# Altium schematic sheet WakameBoard.SchDoc
size 569 x 459 mm
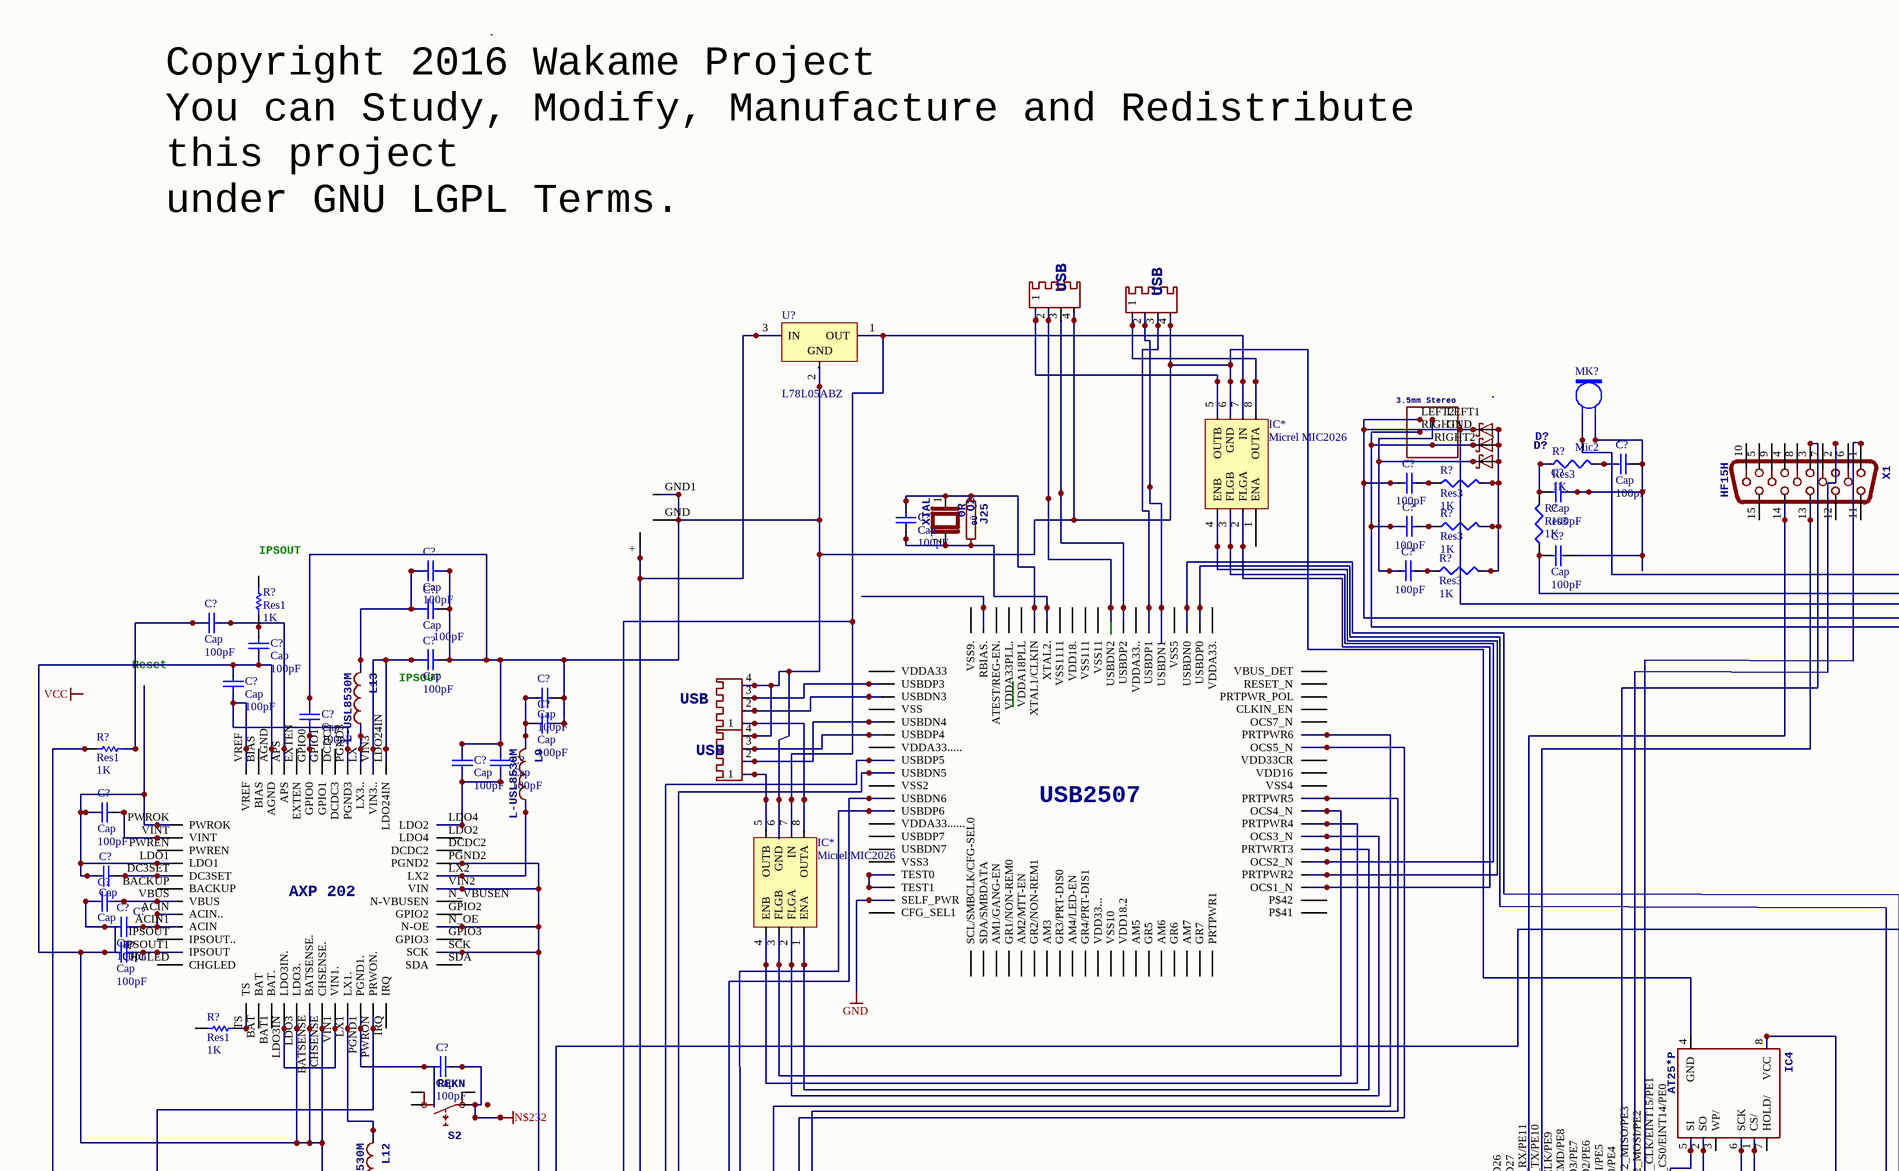
[diagram p0: WakameBoard.SchDoc, top left]
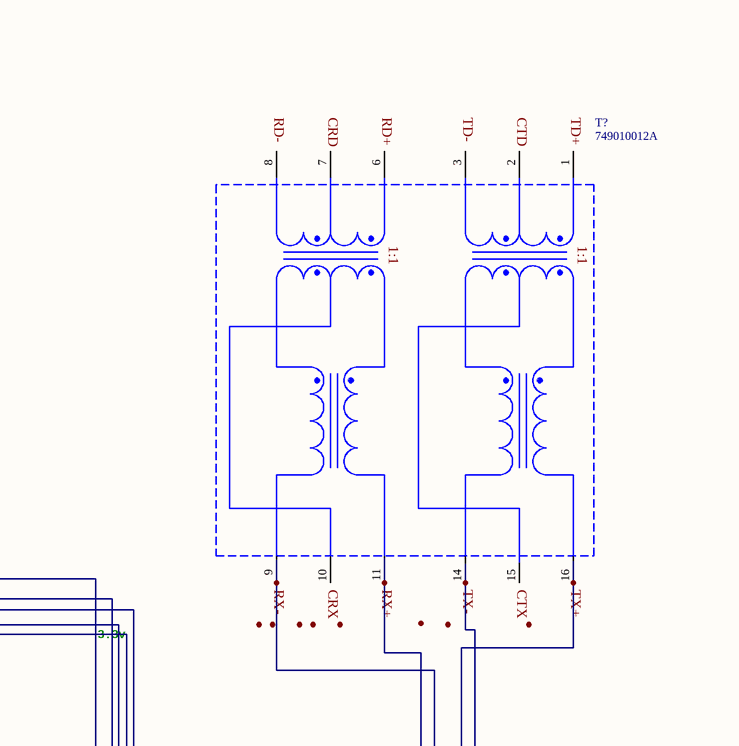
[diagram p1: WakameBoard.SchDoc, top right]
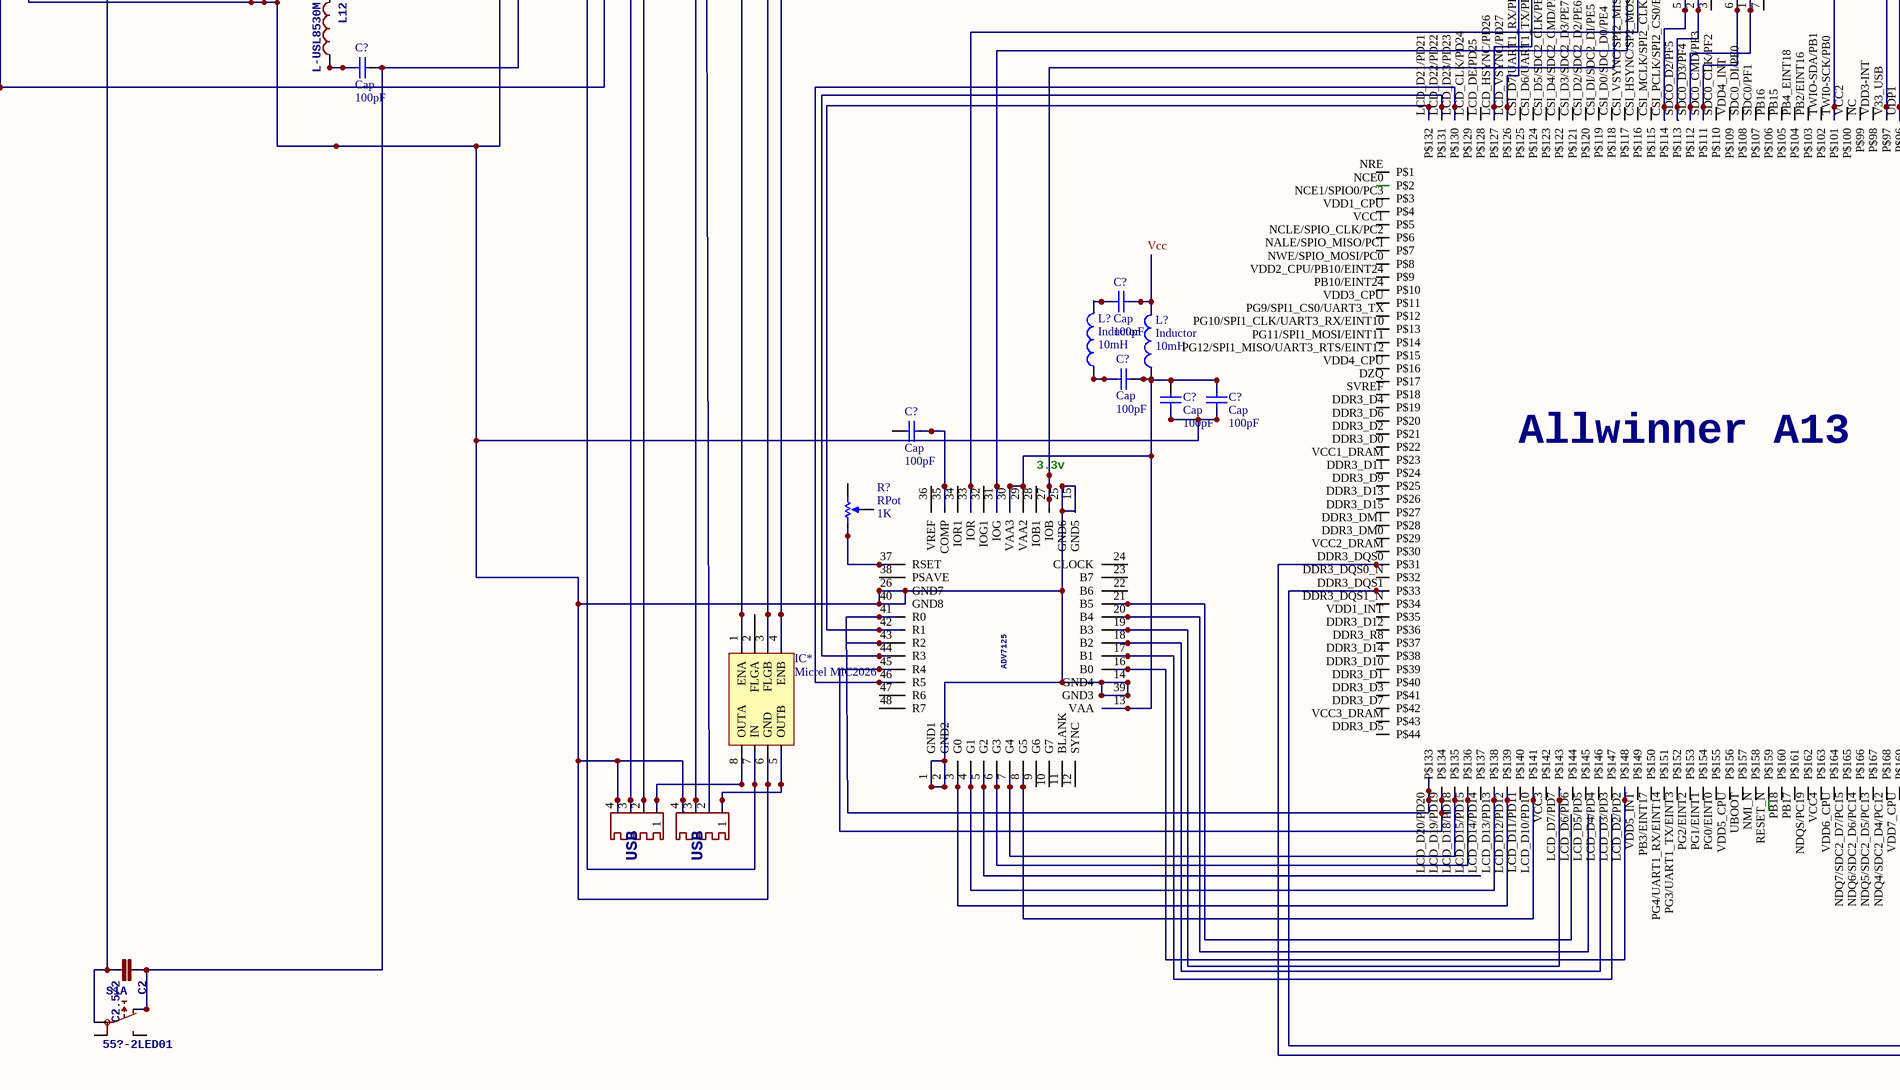
[diagram p2: WakameBoard.SchDoc, bottom left]
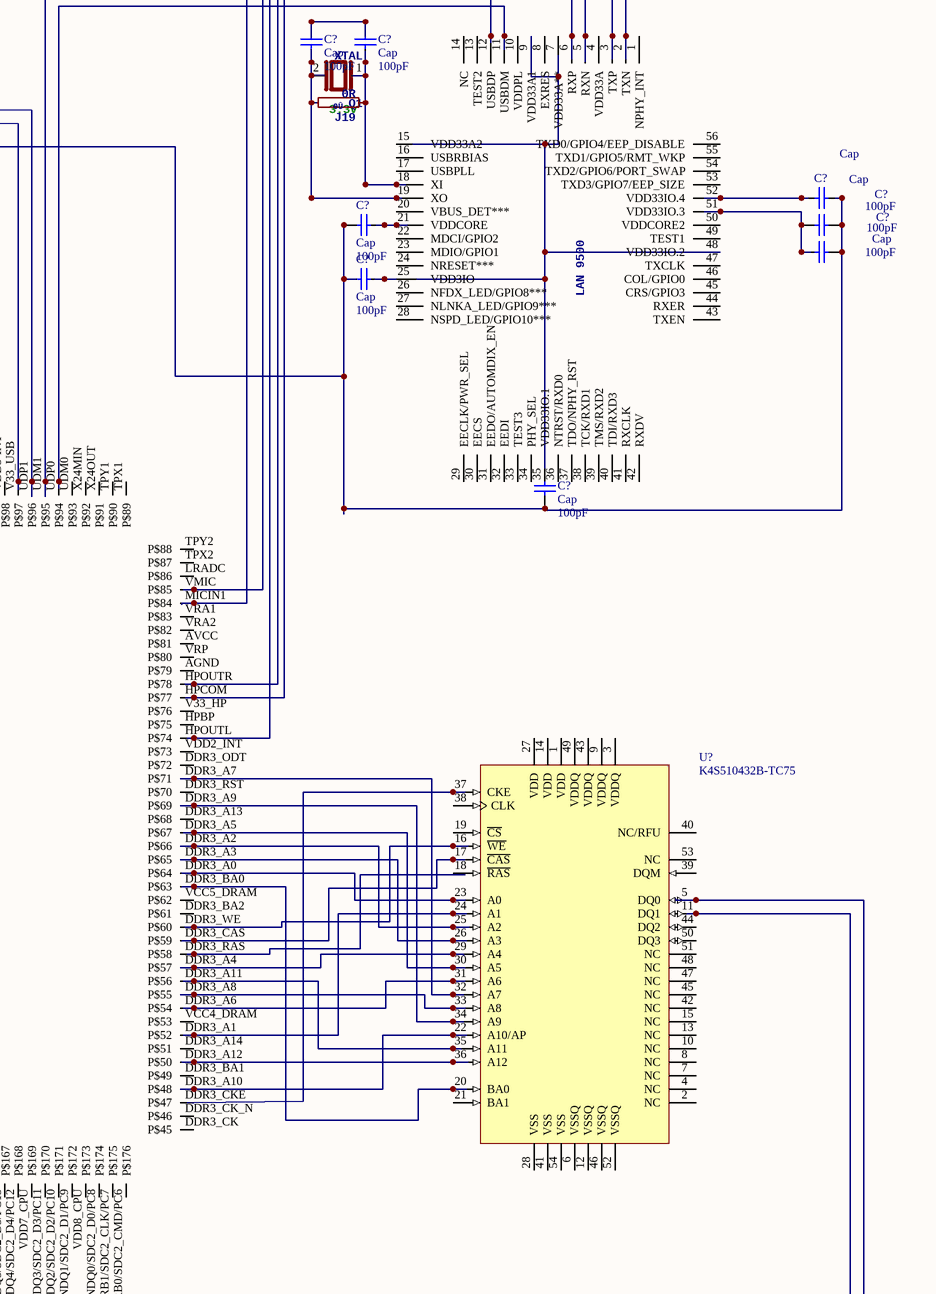
[diagram p3: WakameBoard.SchDoc, bottom right]

## Parts
(Parts that share a designator on the sheet are numbered #1, #2 ... from top to bottom, then left to right.)
C2  C2.5/2  [C2.5-2]
C?#1  Cap  value 100pF  [RAD-0.3]
C?#2  .  value 100pF  [RAD-0.3]
C?#3  Cap  value 100pF  [RAD-0.3]
C?#4  .  value 100pF  [RAD-0.3]
C?#5  Cap  value 100pF  [RAD-0.3]
C?#6  Cap  value 100pF  [RAD-0.3]
C?#7  Cap  value 100pF  [RAD-0.3]
C?#8  .  value 100pF  [RAD-0.3]
C?#9  Cap  value 100pF  [RAD-0.3]
C?#10  Cap  value 100pF  [RAD-0.3]
C?#11  Cap  value 100pF  [RAD-0.3]
C?#12  Cap  value 100pF  [RAD-0.3]
C?#13  Cap  value 100pF  [RAD-0.3]
C?#14  Cap  value 100pF  [RAD-0.3]
C?#15  Cap  value 100pF  [RAD-0.3]
C?#16  Cap  value 100pF  [RAD-0.3]
C?#17  Cap  value 100pF  [RAD-0.3]
C?#18  Cap  value 100pF  [RAD-0.3]
C?#19  Cap  value 100pF  [RAD-0.3]
C?#20  Cap  value 100pF  [RAD-0.3]
C?#21  Cap  value 100pF  [RAD-0.3]
C?#22  Cap  [RAD-0.3]
C?#23  Cap  [RAD-0.3]
C?#24  Cap  value 100pF  [RAD-0.3]
C?#25  Cap  value 100pF  [RAD-0.3]
C?#26  Cap  value 100pF  [RAD-0.3]
C?#27  Cap  value 100pF  [RAD-0.3]
C?#28  Cap  value 100pF  [RAD-0.3]
C?#29  Cap  value 100pF  [RAD-0.3]
C?#30  Cap  value 100pF  [RAD-0.3]
C?#31  Cap  value 100pF  [RAD-0.3]
C?#32  Cap  value 100pF  [RAD-0.3]
C?#33  Cap  value 100pF  [RAD-0.3]
C?#34  Cap  value 100pF  [RAD-0.3]
C?#35  Cap  value 100pF  [RAD-0.3]
C?#36  Cap  value 100pF  [RAD-0.3]
C?#37  Cap  value 100pF  [RAD-0.3]
C?#38  Cap  value 100pF  [RAD-0.3]
D?#1  .  [DIODE_DO35-7]
D?#2  .  [DIODE_DO35-7]
D?#3  .  [DIODE_DO35-7]
IC4  AT25*P  [DIL08]
IC*#1  Micrel MIC2026  [8-Pin SOIC]
IC*#2  Micrel MIC2026  [8-Pin SOIC]
IC*#3  Micrel MIC2026  [8-Pin SOIC]
J19  0R  [0R/10]
J25  0R  [0R/10]
L9  L-USL8530M  [L8530M]
L12  L-USL8530M  [L8530M]
L13  L-USL8530M  [L8530M]
L?#1  Inductor  value 10mH  [0402-A]
L?#2  Inductor  value 10mH  [0402-A]
MK?  Mic2  [PIN2]
Q1  XTAL  [Q]
Q2  XTAL  [Q]
R?#1  Res3  value 1K  [J1-0603]
R?#2  Res3  value 1K  [J1-0603]
R?#3  Res3  value 1K  [J1-0603]
R?#4  Res3  value 1K  [J1-0603]
R?#5  Res3  value 1K  [J1-0603]
R?#6  Res1  value 1K  [AXIAL-0.3]
R?#7  Res1  value 1K  [AXIAL-0.3]
R?#8  Res1  value 1K  [AXIAL-0.3]
R?#9  RPot  value 1K  [VR5]
S1  55?-2LED01  [5501-2LED]  (part A of 3)
S2  REKN  [REKN]
T?  749010012A  [749010012A]
U$1  ALLWINNER-A13  [PG-LQFP-176-2]  (value not drawn)
U$3  ADV7125  [LFCSP48]
U$4  AXP202  [QFN48]  (value not drawn)
U$6  PWR  [SCD-014-A]  (value not drawn)
U$7  LAN9500  [QFN56]  (value not drawn)
U$10  35MMSTEREOJACK  [PG203J]  (value not drawn)
U$11  USB2507  [TQFP80]
U?#1  L78L05ABZ  [TO92]
U?#2  K4S510432B-TC75  [54_TSOP2_400AF_N]
X1  HF15H  [HDF15H]
X2  USB-A003  [USB-A003]  (value not drawn)
X3  USB-A003  [USB-A003]  (value not drawn)
X4  USB-A003  [USB-A003]  (value not drawn)
X5  USB-A003  [USB-A003]  (value not drawn)
X6  USB-A003  [USB-A003]  (value not drawn)
X7  USB-A003  [USB-A003]  (value not drawn)

## Nets
GND: U$11.SELF_PWR
N$232: C?#31.2 S2.0A
NetC2_1: C2.1 C?#26.2 C?#27.1 C?#28.2 C?#29.2 C?#30.1 C?#32.2 C?#33.1 S1.NC
NetC2_2: C2.2 S1.1A U$4.PWRON(PRWON.)
NetC?#1_1: C?#1.1 R?#1.2
NetC?#1_2: C?#1.2 C?#3.2 C?#6.2 MK?.2
NetC?#2_1: C?#2.1 D?#1.C(A) U$1.HPCOM(P$77) U$1.HPOUTL(P$74) U$10.LEFT2(P$3)
NetC?#2_2: C?#2.2 R?#2.1
NetC?#3_1: C?#3.1 R?#1.1 R?#4.2
NetC?#4_1: C?#4.1 D?#2.C(A) U$1.HPOUTR(P$78) U$10.RIGHT1(P$4) U$10.RIGHT2(P$5)
NetC?#4_2: C?#4.2 R?#3.1
NetC?#5_1: C?#5.1 J25.2 Q2.2 U$11.XTAL2(XTAL2.)
NetC?#5_2: C?#5.2 J25.1 Q2.1 U$11.XTAL1/CLKIN
NetC?#6_1: C?#6.1 R?#4.1 U$1.VMIC(P$85)
NetC?#7_1: C?#7.1 C?#9.1 L13.2
NetC?#7_2: C?#7.2 C?#9.2 C?#11.2 C?#13.2 C?#15.1 C?#16.2 C?#17.2 C?#18.2 IC4.4(GND) IC*#1.6(GND) IC*#2.6(GND) U$6.GND U$6.GND1 U?#1.2(GND) X2.4 X3.4 X6.4 X7.4
NetC?#8_1: C?#8.1 D?#3.C(A)
NetC?#8_2: C?#8.2 R?#5.1
NetC?#10_1: C?#10.1 R?#7.2
NetC?#10_2: C?#10.2 U$4.APS
NetC?#11_1: C?#11.1 U$4.LDO24IN U$4.VIN3(VIN3..)
NetC?#12_1: C?#12.1 C?#14.2 C?#23.1 C?#24.1 C?#25.1 C?#36.2 C?#37.1 IC*#3.6(GND) U$3.1(GND1) U$3.2(GND2) U$3.14(GND4) U$3.15(GND5) U$3.25(GND6) U$3.26(GND7) U$3.39(GND3) U$3.40(GND8) U$4.AGND U$4.BATSENSE(BATSENSE.) U$4.CHSENSE(CHSENSE.) U$4.LDO3(LDO3.) U$4.N_OE(N-OE) U$4.PGND2 U$4.SCK U$4.VIN2(VIN) X4.4 X5.4
NetC?#12_2: C?#12.2 R?#6.1
NetC?#13_1: C?#13.1 C?#16.1 L9.2
NetC?#14_1: C?#14.1 U$4.PGND3 U$4.VREF
NetC?#15_2: C?#15.2 U$4.GPIO0
NetC?#17_1: C?#17.1 C?#18.1 U$4.LDO4(LDO2)
NetC?#19_1: C?#19.1 C?#22.1 U$4.LDO1 U$4.PWROK
NetC?#19_2: C?#19.2 U$4.VINT
NetC?#20_1: C?#20.1 C?#21.1
NetC?#20_2: C?#20.2 J19.2 Q1.2 U$7.19(XO)
NetC?#21_2: C?#21.2 J19.1 Q1.1 U$7.18(XI)
NetC?#22_2: C?#22.2 U$4.DC3SET
NetC?#23_2: C?#23.2 U$4.VBUS
NetC?#24_2: C?#24.2 U$4.ACIN(ACIN..) U$4.ACIN1(ACIN)
NetC?#25_2: C?#25.2 U$4.IPSOUT1(IPSOUT)
NetC?#26_1: C?#26.1 U$7.52(VDD33IO.4)
NetC?#27_2: C?#27.2 U$7.21(VDDCORE)
NetC?#28_1: C?#28.1 C?#29.1 U$7.51(VDD33IO.3)
NetC?#30_2: C?#30.2 U$7.25(VDD3IO)
NetC?#31_1: C?#31.1 U$4.PGND1(PGND1.)
NetC?#32_1: C?#32.1 L12.1
NetC?#33_2: C?#33.2 U$7.9(VDD33A1) U$7.48(VDD33IO.2)
NetC?#34_1: C?#34.1 L?#2.2
NetC?#35_1: C?#35.1 C?#36.1 C?#37.2 L?#2.1 U$3.13(VAA) U$3.29(VAA2) U$3.30(VAA3)
NetC?#35_2: C?#35.2 L?#1.1
NetC?#38_1: C?#38.1 U$3.35(COMP)
NetD?#1_A: D?#1.A(C) D?#2.A(C) D?#3.A(C) R?#2.2 R?#3.2 R?#5.2
NetIC4_1: IC4.1(CS/) U$1.SDC0_D3/PF4(P$112)
NetIC4_2: IC4.2(SO) U$1.SDCO_D2/PF5(P$113)
NetIC4_5: IC4.5(SI) U$1.CSI_PCLK/SPI2_CS0/EINT14/PE0(P$114)
NetIC4_6: IC4.6(SCK) U$1.SDC0_CMD/PF3(P$111)
NetIC4_8: IC4.8(VCC) U$1.TWI0-SCK/PB0(P$101)
NetIC*#1_2: IC*#1.2(FLGA) U$11.OCS2_N(OCS1_N)
NetIC*#1_3: IC*#1.3(FLGB) U$11.OCS3_N(OCS2_N)
NetIC*#1_4: IC*#1.4(ENB) U$11.PRTPWR3(PRTPWR2)
NetIC*#1_5: IC*#1.5(OUTB) X3.1
NetIC*#1_7: IC*#1.7(IN) IC*#2.7(IN) IC*#3.7(IN) U?#1.1(OUT)
NetIC*#1_8: IC*#1.8(OUTA) X2.1
NetIC*#2_1: IC*#2.1(ENA) U$11.PRTPWR4(PRTWRT3)
NetIC*#2_2: IC*#2.2(FLGA) U$11.OCS4_N(OCS3_N)
NetIC*#2_3: IC*#2.3(FLGB) U$11.VSS5(OCS4_N)
NetIC*#2_4: IC*#2.4(ENB) U$11.PRTPWR5(PRTPWR4)
NetIC*#2_5: IC*#2.5(OUTB) X6.1
NetIC*#2_8: IC*#2.8(OUTA) X7.1
NetIC*#3_1: IC*#3.1(ENA) U$11.PRTPWR7(PRTPWR6)
NetIC*#3_3: IC*#3.3(FLGB) U$11.OCS6_N(OCS5_N)
NetIC*#3_4: IC*#3.4(ENB) U$11.VDD18.2(PRTPWR5)
NetIC*#3_5: IC*#3.5(OUTB) X4.1
NetIC*#3_8: IC*#3.8(OUTA) X5.1
NetL9_1: L9.1 U$4.LX2
NetL12_2: L12.2 U$4.LX1(LX1.)
NetL13_1: L13.1 U$4.LX(LX3..)
NetMK?_1: MK?.1 U$1.MICIN1(P$84)
NetR?#7_1: R?#7.1 U$6.+ U?#1.3(IN)
NetR?#8_2: R?#8.2 U$4.TS
NetR?#9_1: R?#9.1(TOP) U$3.37(RSET)
NetT?_9: T?.9(RX-) U$7.5(RXN)
NetT?_11: T?.11(RX+) U$7.6(RXP)
NetT?_14: T?.14(TX-) U$7.2(TXN)
NetT?_16: T?.16(TX+) U$7.3(TXP)
NetU$1_DDR3_A0: U$1.DDR3_A0(P$64) U?#2.23(A0)
NetU$1_DDR3_A1: U$1.DDR3_A1(P$52) U?#2.24(A1)
NetU$1_DDR3_A2: U$1.DDR3_A2(P$66) U?#2.25(A2)
NetU$1_DDR3_A3: U$1.DDR3_A3(P$65) U?#2.26(A3)
NetU$1_DDR3_A4: U$1.DDR3_A4(P$57) U?#2.29(A4)
NetU$1_DDR3_A5: U$1.DDR3_A5(P$67) U?#2.30(A5)
NetU$1_DDR3_A6: U$1.DDR3_A6(P$54) U?#2.31(A6)
NetU$1_DDR3_A7: U$1.DDR3_A7(P$71) U?#2.32(A7)
NetU$1_DDR3_A8: U$1.DDR3_A8(P$55) U?#2.33(A8)
NetU$1_DDR3_A9: U$1.DDR3_A9(P$69) U?#2.34(A9)
NetU$1_DDR3_A10: U$1.DDR3_A10(P$48) U?#2.22(A10/AP)
NetU$1_DDR3_A11: U$1.DDR3_A11(P$56) U?#2.35(A11)
NetU$1_DDR3_A12: U$1.DDR3_A12(P$50) U?#2.36(A12)
NetU$1_DDR3_BA0: U$1.DDR3_BA0(P$63) U?#2.20(BA0)
NetU$1_DDR3_CAS: U$1.DDR3_CAS(P$59) U?#2.17(~{CAS})
NetU$1_DDR3_CKE: U$1.DDR3_CKE(P$47) U?#2.37(CKE)
NetU$1_DDR3_DQS0: U$1.DDR3_DQS0(P$31) U?#2.5(DQ0)
NetU$1_DDR3_DQS1: U$1.DDR3_DQS1(P$33) U?#2.11(DQ1)
NetU$1_DDR3_WE: U$1.DDR3_WE(P$60) U?#2.16(~{WE})
NetU$1_LCD_D2/PD2: U$1.LCD_D2/PD2(P$148) U$3.16(B0)
NetU$1_LCD_D7/PD7: U$1.LCD_D7/PD7(P$143) U$3.19(B3)
NetU$1_LCD_D10/PD10: U$1.LCD_D10/PD10(P$141) U$3.8(G5)
NetU$1_LCD_D12/PD12: U$1.LCD_D12/PD12(P$139) U$3.3(G0)
NetU$1_LCD_D13/PD13: U$1.LCD_D13/PD13(P$138) U$3.4(G1)
NetU$1_LCD_D15/PD15: U$1.LCD_D15/PD15(P$136) U$3.6(G3)
NetU$1_LCD_D18/PD18: U$1.LCD_D18/PD18(P$135) U$3.7(G4)
NetU$1_LCD_D19/PD19: U$1.LCD_D19/PD19(P$134) U$3.45(R4)
NetU$1_LCD_D20/PD20: U$1.LCD_D20/PD20(P$133) U$3.41(R0) U$3.43(R2)
NetU$1_LCD_D21/PD21: U$1.LCD_D21/PD21(P$132) U$3.42(R1)
NetU$1_LCD_D22/PD22: U$1.LCD_D22/PD22(P$131) U$3.44(R3)
NetU$1_LCD_D23/PD23: U$1.LCD_D23/PD23(P$130) U$3.46(R5)
NetU$1_LCD_HSYNC/PD26: U$1.LCD_HSYNC/PD26(P$127) X1.13
NetU$1_LCD_VSYNC/PD27: U$1.LCD_VSYNC/PD27(P$126) X1.14
NetU$1_UDM1: U$1.UDM1(P$95) U$7.12(USBDP)
NetU$1_UDP0: U$1.UDP0(P$94) U$7.11(USBDM)
NetU$1_UDP1: U$1.UDP1(P$96) U$11.USBDN0
NetU$1_V33_USB: U$1.V33_USB(P$97) U$11.USBDP0
NetU$3_27: U$3.27(IOB) X1.3
NetU$3_31: U$3.31(IOG) X1.2
NetU$3_33: U$3.33(IOR) X1.1
NetU$4_LDO3IN: U$4.LDO3IN(LDO3IN.) U$4.VIN1(VIN1.)
NetU$11_TEST0: U$11.TEST0 U$11.TEST1
NetU$11_USBDN1: U$11.USBDN1 X2.2
NetU$11_USBDN2: U$11.USBDN2 X3.2
NetU$11_USBDN3: U$11.USBDN3 X7.2
NetU$11_USBDN4: U$11.USBDN4 X6.2
NetU$11_USBDN5: U$11.USBDN5 X5.2
NetU$11_USBDN6: U$11.USBDN6 X4.3
NetU$11_USBDP1: U$11.USBDP1 X2.3
NetU$11_USBDP2: U$11.USBDP2 X3.3
NetU$11_USBDP3: U$11.USBDP3 X7.3
NetU$11_USBDP4: U$11.USBDP4 X6.3
NetU$11_USBDP5: U$11.USBDP5 X5.3
NetU$11_USBDP6: U$11.USBDP6 X4.2

Not connected (* = marked no-connect by the designer): C?#34 2; C?#38 2; IC4 3(WP/) 7(HOLD/); IC*#1 1(ENA); IC*#3 2(FLGA); L?#1 2; R?#6 2; R?#8 1; R?#9 2(BOT) 3(TAP); S1 1B NO; S2 0B(0) 1A(1) 1B(1); T? 1(TD+) 2(CTD) 3(TD-) 6(RD+) 7(CRD) 8(RD-) 10(CRX) 15(CTX); U$1 AGND(P$79) AVCC(P$81) CSI_D0/SDC_D0/PE4(P$118) CSI_D2/SDC2_D2/PE6(P$120) CSI_D3/SDC2_D3/PE7(P$121) CSI_D4/SDC2_CMD/PE8(P$122) CSI_D5/SDC2_CLK/PE9(P$123) CSI_D6/UART1_TX/PE10(P$124) CSI_D7/UART1_RX/PE11(P$125) CSI_DI/SDC2_DI/PE5(P$119) CSI_HSYNC/SP2_MOSI/PE2(P$116) CSI_MCLK/SPI2_CLK/EINT15/PE1(P$115) CSI_VSYNC/SPI2_MISO/PE3(P$117) DDR3_A13(P$68) DDR3_A14(P$51) DDR3_BA1(P$49) DDR3_BA2(P$61) DDR3_CK(P$45) DDR3_CK_N(P$46) DDR3_D0(P$22) DDR3_D1(P$40) DDR3_D2(P$21) DDR3_D3(P$41) DDR3_D4(P$19) DDR3_D5(P$44) DDR3_D6(P$20) DDR3_D7(P$42) DDR3_D9(P$25) DDR3_D10(P$39) DDR3_D11(P$24) DDR3_D12(P$36) DDR3_D13(P$26) DDR3_D14(P$38) DDR3_D15(P$27) DDR3_DM0(P$29) DDR3_DM1(P$28) DDR3_DQS0_N(P$32) DDR3_DQS1_N(P$34) DDR3_ODT(P$72) DDR3_R8(P$37) DDR3_RAS(P$58) DDR3_RST(P$70) DZQ(P$17) HPBP(P$75) LCD_CLK/PD24(P$129) LCD_D3/PD3(P$147) LCD_D4/PD4(P$146) LCD_D5/PD5(P$145) LCD_D6/PD6(P$144) LCD_D11/PD11(P$140) LCD_D14/PD14(P$137) LCD_DE/PD25(P$128) LRADC(P$86) NALE/SPIO_MISO/PCI(P$7) NC(P$99) NCE0(P$2) NCE1/SPIO0/PC3(P$3) NCLE/SPIO_CLK/PC2(P$6) NDQ0/SDC2_D0/PC8(P$174) NDQ1/SDC2_D1/PC9(P$172) NDQ2/SDC2_D2/PC10(P$171) NDQ3/SDC2_D3/PC11(P$170) NDQ4/SDC2_D4/PC12(P$168) NDQ5/SDC2_D5/PC13(P$167) NDQ6/SDC2_D6/PC14(P$166) NDQ7/SDC2_D7/PC15(P$165) NDQS/PC19(P$162) NMI_N(P$158) NRB0/SDC2_CMD/PC6(P$176) NRB1/SDC2_CLK/PC7(P$175) NRE(P$1) NWE/SPIO_MOSI/PC0(P$8) PB2/EINT16(P$103) PB3/EINT17(P$150) PB4_EINT18(P$104) PB10/EINT24(P$10) PB15(P$105) PB16(P$106) PB17(P$161) PB18(P$160) PG0/EINT0(P$155) PG1/EINT1(P$154) PG2/EINT2(P$153) PG3/UART1_TX/EINT3(P$152) PG4/UART1_RX/EINT14(P$151) PG9/SPI1_CS0/UART3_TX(P$12) PG10/SPI1_CLK/UART3_RX/EINT10(P$13) PG11/SPI1_MOSI/EINT11(P$14) PG12/SPI1_MISO/UART3_RTS/EINT12(P$15) RESET_N(P$159) SDC0/PF1(P$107) SDC0_CLK/PF2(P$110) SDC0_DI/PF0(P$108) SVREF(P$18) TPX1(P$89) TPX2(P$87) TPY1(P$90) TPY2(P$88) TWIO-SDA/PB1(P$102) UBOOT(P$157) UDM0(P$93) V33_HP(P$76) VCC1(P$5) VCC1_DRAM(P$23) VCC2(P$100) VCC2_DRAM(P$30) VCC3(P$142) VCC3_DRAM(P$43) VCC4(P$163) VCC4_DRAM(P$53) VCC5_DRAM(P$62) VDD1_CPU(P$4) VDD1_INT(P$35) VDD2_CPU/PB10/EINT24(P$9) VDD2_INT(P$73) VDD3-INT(P$98) VDD3_CPU(P$11) VDD4_CPU(P$16) VDD4_INT(P$109) VDD5_CPU(P$156) VDD5_INT(P$149) VDD6_CPU(P$164) VDD7_CPU(P$169) VDD8_CPU(P$173) VRA1(P$83) VRA2(P$82) VRP(P$80) X24MIN(P$92) X24OUT(P$91); U$3 5(G2) 9(G6) 10(G7) 11(BLANK) 12(SYNC) 17(B1) 18(B2) 20(B4) 21(B5) 22(B6) 23(B7) 24(CLOCK) 28(IOB1) 32(IOG1) 34(IOR1) 36(VREF) 38(PSAVE) 47(R6) 48(R7); U$4 BACKUP BAT BAT1(BAT.) BIAS CHGLED DCDC2 DCDC3 EXTEN GPIO1 GPIO2 GPIO3 IPSOUT(IPSOUT..) IRQ LDO2(LDO4) N_VBUSEN(N-VBUSEN) PWREN SDA; U$7 1(NPHY_INT) 4(VDD33A) 7(VDD33A**) 8(EXRES) 10(VDDPL) 13(TEST2) 14(NC) 15(VDD33A2) 16(USBRBIAS) 17(USBPLL) 20(VBUS_DET***) 22(MDCI/GPIO2) 23(MDIO/GPIO1) 24(NRESET***) 26(NFDX_LED/GPIO8***) 27(NLNKA_LED/GPIO9***) 28(NSPD_LED/GPIO10***) 29(EECLK/PWR_SEL) 30(EECS) 31(EEDO/AUTOMDIX_EN) 32(EEDI) 33(TEST3) 34(PHY_SEL) 35(VDD33IO.1) 36(NTRST/RXD0) 37(TDO/NPHY_RST) 38(TCK/RXD1) 39(TMS/RXD2) 40(TDI/RXD3) 41(RXCLK) 42(RXDV) 43(TXEN) 44(RXER) 45(CRS/GPIO3) 46(COL/GPIO0) 47(TXCLK) 49(TEST1) 50(VDDCORE2) 53(TXD3/GPIO7/EEP_SIZE) 54(TXD2/GPIO6/PORT_SWAP) 55(TXD1/GPIO5/RMT_WKP) 56(TXD0/GPIO4/EEP_DISABLE); U$10 GND(P$1) LEFT1(P$2); U$11 AM1/GANG_EN(AM1/GANG-EN) AM2/MTT_EN(AM2/MTT-EN) AM3 AM4/LED_EN(AM4/LED-EN) AM5 AM6 AM7 ATEST/REG_EN(ATEST/REG-EN.) CFG_SEL1 CLKIN_EN GR1/NON_REM0(GR1/NON-REM0) GR2_NON_REM1(GR2/NON-REM1) GR3/PRT_DIS0(GR3/PRT-DIS0) GR4/PRT_DIS1(GR4/PRT-DIS1) GR5 GR6 GR7 OCS1_N(P$41) OCS5_N(VDD16) OCS7_N PRTPWR1 PRTPWR2(P$42) PRTPWR6(VDD33CR) PRTPWR_POL RBIAS(RBIAS.) RESET_N SCL/SMBCLK/CFG_SEL0(SCL/SMBCLK/CFG-SEL0) SDA/SMBDATA USBDN7 USBDP7 VBUS_DET VDD18(VDD18.2) VDD18.3(VDD18.) VDD33(VDDA33) VDD33.3(VDD33...) VDD33CR(VSS4) VDDA3.1(VDDA33..) VDDA18/PLL(VDDA18PLL) VDDA33(VDDA33.....) VDDA33.2(VDDA33......) VDDA33.4(VDDA33.) VDDA33/PLL(VDDA33PLL.) VSS VSS0(VSS9.) VSS1(VSS2) VSS3 VSS4(VSS10) VSS6(VSS5) VSS7(VSS11) VSS8(VSS111) VSS9(VSS1111); U?#2 1(VDD) 2(NC) 3(VDDQ) 4(NC) 6(VSSQ) 7(NC) 8(NC) 9(VDDQ) 10(NC) 12(VSSQ) 13(NC) 14(VDD) 15(NC) 18(~{RAS}) 19(~{CS}) 21(BA1) 27(VDD) 28(VSS) 38(CLK) 39(DQM) 40(NC/RFU) 41(VSS) 42(NC) 43(VDDQ) 44(DQ2) 45(NC) 46(VSSQ) 47(NC) 48(NC) 49(VDDQ) 50(DQ3) 51(NC) 52(VSSQ) 53(NC) 54(VSS); X1 4 5 6 7 8 9 10 11 12 15

## Notes on the sheet
- Copyright 2016 Wakame Project
  You can Study, Modify, Manufacture and Redistribute this project
  under GNU LGPL Terms.
- Text
- (near R?#6) IPSOUT
- 3.3v
- Reset
- (near C?#11) IPSOUT
- (near J19) 3.3v
- (near U$3) 3.3v
- Labels drawn without touching a wire or pin: Vcc, VCC
- (in symbol 749010012A) 1:1

## Library data of the parts
C2 = C2.5/2: <B>CAPACITOR</B><p> / naming: grid - package width
C?#1-C?#38 = Cap: Capacitor; Published: 8-Jun-2000; LatestRevisionDate: 17-Jul-2002; LatestRevisionNote: Re-released for DXP Platform.; PackageReference: RAD-0.3; Publisher: Altium Limited
D?#1-D?#3 = SCHOTTKY-DIODEDO35-7: SPICEMODEL: NONE; SPICEPREFIX: D; SPICETYPE: diode
IC4 = AT25*P: SPI bus serial <B>EEPROM</B>; MPN: CAT25040LI-G; OC_FARNELL: 1718045; OC_NEWARK: 06R0588
IC*#1-IC*#3 = MIC2026: Micrel MIC2026 Dual-Channel Power Distribution Switch
J19 J25 = 0R: Bridge 0R 10mm; 0Û: 0Û
L9 L12 L13 = L-USL8530M: <B>INDUCTOR</B>, American symbol
L?#1 L?#2 = Inductor: Code_IEC: 1005; Published: 8-Jun-2000; LatestRevisionDate: 17-Jul-2002; LatestRevisionNote: Re-released for DXP Platform.; PackageReference: 0402-A; Publisher: Altium Limited; Code_JEITA: 0402
MK? = Mic2: Microphone; Published: 24-Mar-1999; LatestRevisionDate: 17-Jul-2002; LatestRevisionNote: Re-released for DXP Platform.; PackageReference: PIN2; Publisher: Altium Limited
Q1 Q2 = XTAL: <B>CRYSTAL</B>
R?#1-R?#5 = Res3: Resistor; Published: 8-Jun-2000; LatestRevisionDate: 04-Mar-2005; LatestRevisionNote: PCB Footprint replaced.; PackageReference: J1-0603; Publisher: Altium Limited
R?#6-R?#8 = Res1: Resistor; Published: 8-Jun-2000; LatestRevisionDate: 17-Jul-2002; LatestRevisionNote: Re-released for DXP Platform.; PackageReference: AXIAL-0.3; Publisher: Altium Limited
R?#9 = RPot: Potentiometer; Sim Note: Enter the Resistance value and the set point into parameter fields.; Set Position: 0.5; Published: 8-Jun-2000; LatestRevisionDate: 17-Jul-2002; LatestRevisionNote: Re-released for DXP Platform.; PackageReference: VR5; Publisher: Altium Limited
S1 = 55?-2LED01: <b>PUSHBUTTON SERIES 5500 SWITCHES</b> 2 LED<p> / Source: www.e-switch.com .. 5500.pdf
S2 = REKN: <b>PUSH SWITCH</b><p> / ITT-Cannon-Cannon
T? = 749010012A: 10/100 Base-T SMD Transformer 1 Port; Manufacturer: Wurth Elektronik; ComponentLink1Description: Manufacturer; ComponentLink1URL: http://www.we-online.com; ComponentLink2Description: Datasheet; ComponentLink2URL: http://katalog.we-online.de/pbs/datasheet/749010012A.pdf; Created by: Baojun Chen; Created Date: 27.Oct.2015; partNo: 749010012A
U$4 = AXP202: Allwinner a13 pwr ic; AXP 202: AXP 202
U$6 = PWR: Main Power Jack
U$11 = USB2507: usb 2507 hub on chiip; USB2507: USB2507
U?#1 = L78L05ABZ: Positive Voltage Regulator; Published: 24-Aug-2001; LatestRevisionDate: 17-Jul-2002; LatestRevisionNote: Re-released for DXP Platform.; DatasheetVersion: Feb-1999; PackageReference: TO92; Publisher: Altium Limited; PackageDescription: TO, Flat Index; 3 In-Line, Axial Leads; Body Dia. 4.8mm; Leads 0.51 x 0.51 mm (max); ComponentLink1Description: Manufacturer Link; ComponentLink1URL: http://www.st.com/
U?#2 = K4S510432B-TC75: 512Mb Synchronous High Data Rate DRAM, 32Mb x 4Bit x 4 Banks, 54-Pin TSOP; Frequency: 133MHz (max); RowAddress: A0-A12; ColumnAddress: A0-A9, A11, A12; Published: 11-Oct-2004; LatestRevisionDate: 13-Apr-2006; LatestRevisionNote: IPC-7351 Footprint Added.; DatasheetVersion: rev1.1, Feb-2004; PackageVersion: Aug-2004; PackageReference: 54_TSOP2_400AF; Publisher: Altium Limited; PackageDescription: 54-Pin Small Outline Package 0.8 mm Pitch; ComponentLink1Description: Manufacturer Link; ComponentLink1URL: http://www.samsung.com; ComponentLink2Description: Datasheet; ComponentLink2URL: http://www.samsung.com/Products/Semiconductor/DRAM/SDRAM/SDRAMcomponent/512Mbit/K4S510432B/ds_sdr_512mb_b-die_x4x8x16_11.pdf
X1 = HF15H: <b>SUB-D</b>; OC_FARNELL: unknown; OC_NEWARK: unknown
X2-X7 = USB-A003: <b>USB connector</b>; OC_FARNELL: unknown; OC_NEWARK: unknown; USB: USB
U$1 = ALLWINNER-A13: Allwinner A13: Allwinner A13
U$3 = ADV7125: ADV7125: ADV7125
U$7 = LAN9500: LAN 9500: LAN 9500
U$10 = 35MMSTEREOJACK: 3.5mm Stereo: 3.5mm Stereo